# EAGLE design E6_funk_v2 (EAGLE 6.5.0)
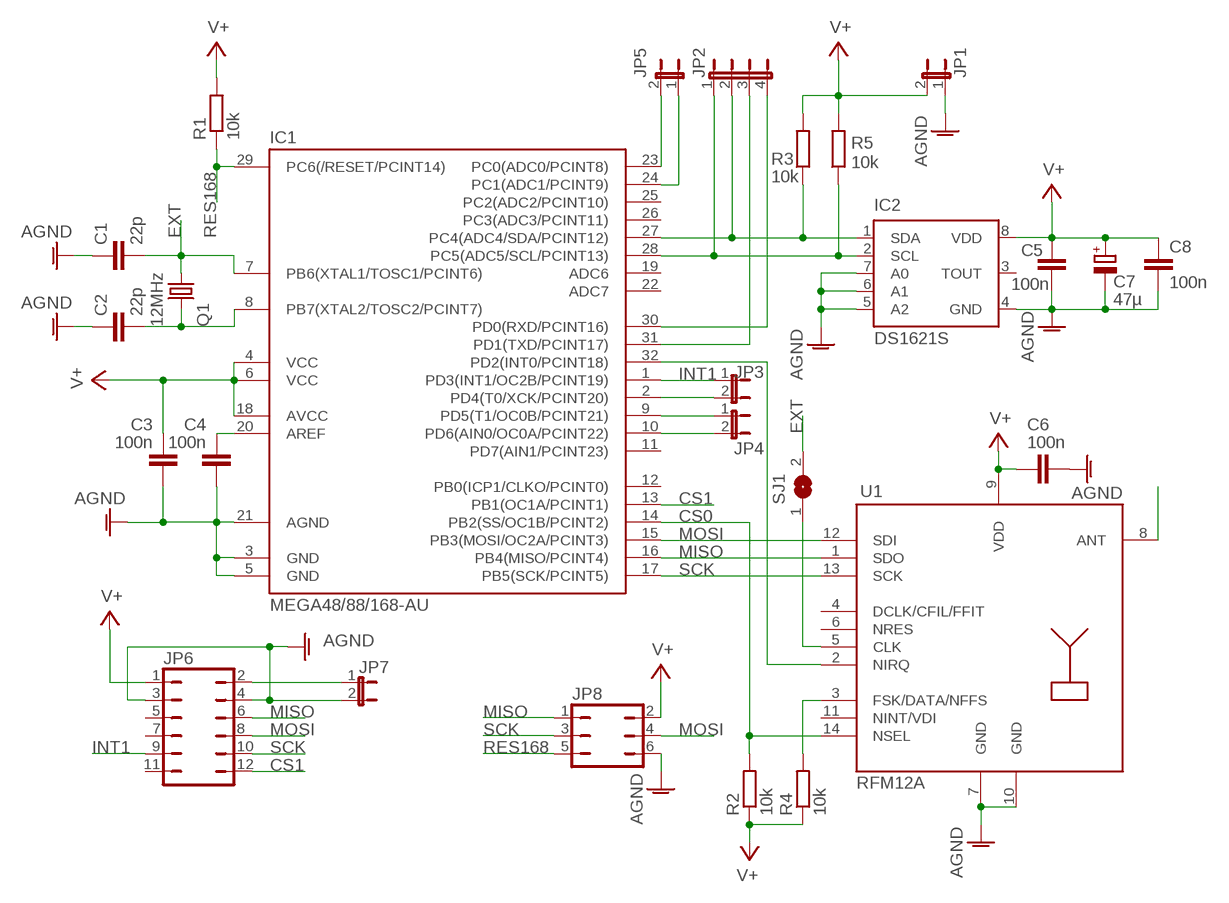
[diagram p0: schematic, sheet 1]

## Parts
C1  22p  C-EUC0805K  [C0805K]
C2  22p  C-EUC0805K  [C0805K]
C3  100n  C-EUC0805K  [C0805K]
C4  100n  C-EUC0805K  [C0805K]
C5  100n  C-EUC0805K  [C0805K]
C6  100n  C-EUC0805K  [C0805K]
C7  47µ  CPOL-EUSMCD  [SMC_D]
C8  100n  C-EUC0805K  [C0805K]
IC1  MEGA48/88/168-AU  [TQFP32-08]
IC2  DS1621S  [SO08]
JP1  JP1E  [JP1]
JP2  JP4E  [JP4]
JP3  JP1E  [JP1]
JP4  JP1E  [JP1]
JP5  JP1E  [JP1]
JP6  JP6Q  [JP6Q]
JP7  JP1E  [JP1]
JP8  JP3Q  [JP3Q]
Q1  12MHz  CRYSTALCTS406  [CTS406]
R1  10k  R-EU_R0805  [R0805]
R2  10k  R-EU_R0805  [R0805]
R3  10k  R-EU_R0805  [R0805]
R4  10k  R-EU_R0805  [R0805]
R5  10k  R-EU_R0805  [R0805]
SJ1  SJ  [SJ]
U1  RFM12A  [RFM1]

## Nets
ADC1: IC1.24(PC1(ADC1/PCINT9)) JP5.1
AGND: C1.2 C2.2 C3.1 C4.1 C5.2 C6.1 C7.- C8.2 IC1.3(GND) IC1.5(GND) IC1.21(AGND) IC2.4(GND) IC2.5(A2) IC2.6(A1) IC2.7(A0) JP1.1 JP6.3 JP6.4 JP7.2 JP8.6 U1.7(GND) U1.10(GND)
CS0: IC1.14(PB2(SS/OC1B/PCINT2)) R2.2 U1.14(NSEL)
CS1: IC1.13(PB1(OC1A/PCINT1)) JP6.12
EXT: C1.1 IC1.7(PB6(XTAL1/TOSC1/PCINT6)) Q1.1 SJ1.2
INT1: IC1.1(PD3(INT1/OC2B/PCINT19)) JP3.1 JP6.9
MISO: IC1.16(PB4(MISO/PCINT4)) JP6.6 JP8.1 U1.1(SDO)
MOSI: IC1.15(PB3(MOSI/OC2A/PCINT3)) JP6.8 JP8.4 U1.12(SDI)
N$1: IC1.23(PC0(ADC0/PCINT8)) JP5.2
N$56: C2.1 IC1.8(PB7(XTAL2/TOSC2/PCINT7)) Q1.3
N$74: IC1.32(PD2(INT0/PCINT18)) U1.2(NIRQ)
N$75: C4.2 IC1.20(AREF)
N$76: SJ1.1 U1.5(CLK)
N$77: R4.2 U1.3(FSK/DATA/NFFS)
N$170: U1.8(ANT)
PD4: IC1.2(PD4(T0/XCK/PCINT20)) JP3.2
PD5: IC1.9(PD5(T1/OC0B/PCINT21)) JP4.1
PD6: IC1.10(PD6(AIN0/OC0A/PCINT22)) JP4.2
RES168: IC1.29(PC6(/RESET/PCINT14)) JP8.5 R1.1
RXD: IC1.30(PD0(RXD/PCINT16)) JP2.4
SCK: IC1.17(PB5(SCK/PCINT5)) JP6.10 JP8.3 U1.13(SCK)
SCL: IC1.28(PC5(ADC5/SCL/PCINT13)) IC2.2(SCL) JP2.1 R5.1
SDA: IC1.27(PC4(ADC4/SDA/PCINT12)) IC2.1(SDA) JP2.2 R3.1
TXD: IC1.31(PD1(TXD/PCINT17)) JP2.3
V+: C3.2 C5.1 C6.2 C7.+ C8.1 IC1.4(VCC) IC1.6(VCC) IC1.18(AVCC) IC2.8(VDD) JP1.2 JP6.1 JP8.2 R1.2 R2.1 R3.2 R4.1 R5.2 U1.9(VDD)
VCC: JP6.2 JP7.1
Unconnected: IC1.11(PD7(AIN1/PCINT23)) IC1.12(PB0(ICP1/CLKO/PCINT0)) IC1.19(ADC6) IC1.22(ADC7) IC1.25(PC2(ADC2/PCINT10)) IC1.26(PC3(ADC3/PCINT11)) IC2.3(TOUT) JP6.5 JP6.7 JP6.11 U1.4(DCLK/CFIL/FFIT) U1.6(NRES) U1.11(NINT/VDI)

## Library data of the parts
C1-C6 C8 = rcl:C-EU: CAPACITOR, European symbol
C7 = rcl:CPOL-EU: POLARIZED CAPACITOR, European symbol
IC1 = avr-4:MEGA48/88/168
IC2 = maxim:DS1621: Digital Thermometer and Thermostat Source: http://pdfserv.maxim-ic.com/en/ds/DS1621.pdf
JP1 JP3-JP5 JP7 = jumper:JP1E: JUMPER
JP2 = jumper:JP4E: JUMPER
JP6 = jumper:JP6Q: JUMPER
JP8 = jumper:JP3Q: JUMPER
Q1 = crystal:CRYSTAL: CRYSTAL
R1-R5 = rcl:R-EU_: RESISTOR, European symbol
SJ1 = jumper:SJ: SMD solder JUMPER
U1 = RFMxx:RFM12A

## Board
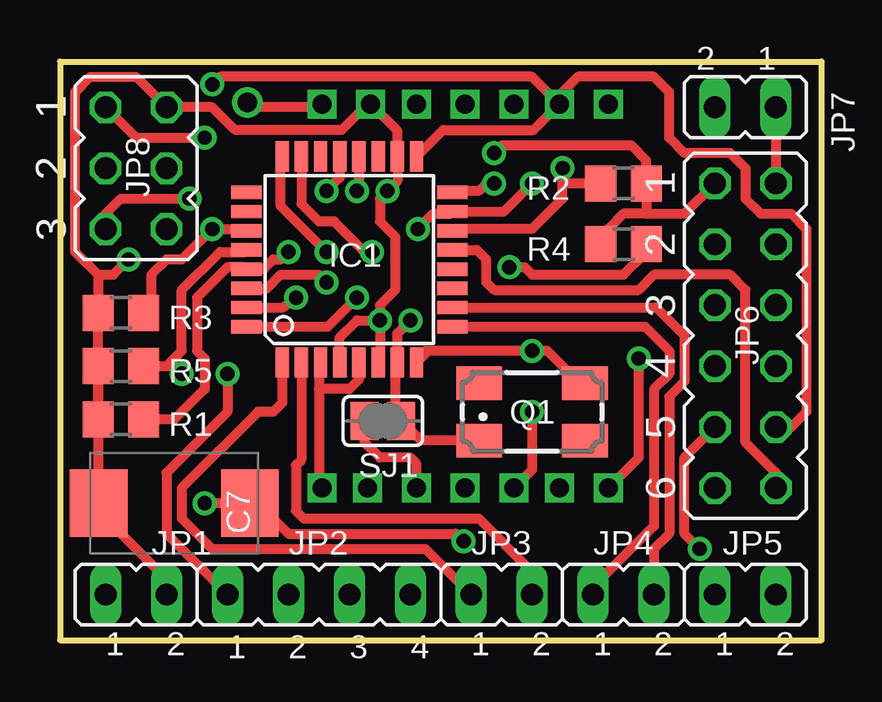
[diagram p1: board, top side]
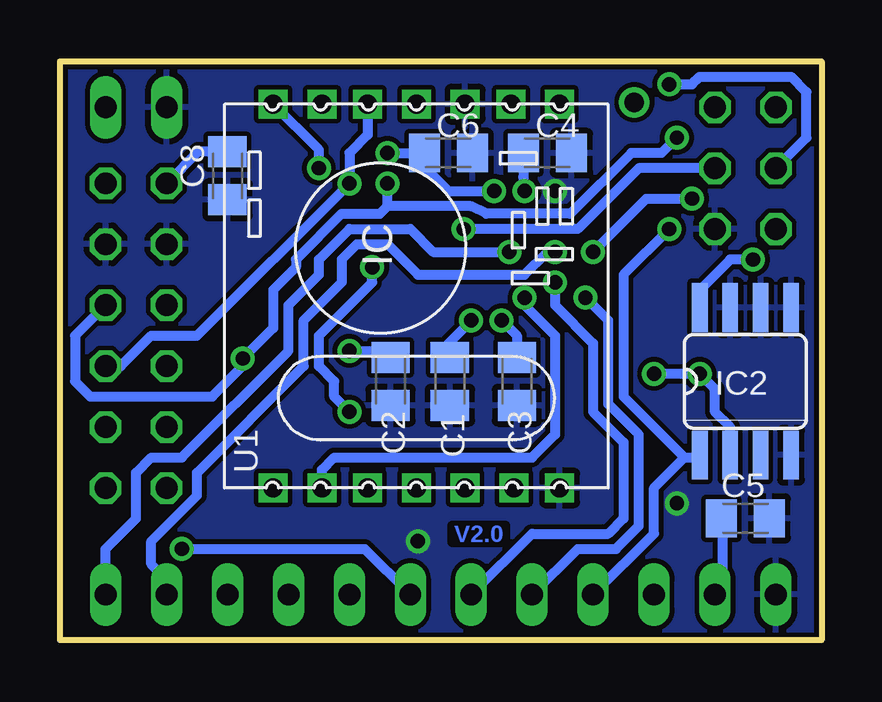
[diagram p2: board, bottom side, seen from below]

Size 31.75 x 24.13 mm. Coordinates in mm from the lower left corner, seen from the top.
Outline: 0,24.13 0,0 31.75,0 31.75,24.13 0,24.13
Copper layers (1*16): Top 0.035mm / dielectric 1.5mm / Bottom 0.035mm
Design rules "ZWILLING": minimum track width 0.2mm, minimum drill 0.5mm, track to track 0.2mm, track to pad 0.2mm, pad to pad 0.15mm, via to via 0.2mm, smd to smd 0mil, copper to edge 0.2mm, drill to drill 0.2mm, minimum pad ring 0.2mm, minimum via ring 0.2mm, stop-mask expansion 0.1mm, vias tented up to drill 0mil, thermal gap 10mil

### Footprints (pad centres in the part's own frame; a part is rotated, then mirrored left to right if it is on the bottom)
C0805K = smd 1.3 x 1.6: 1 -1,0; 2 1,0
SMC_D = smd 2.4 x 2.8: + -3.15,0; - 3.15,0
TQFP32-08 = smd 1.27 x 0.559: 1 -4.293,2.8; 2 -4.293,2; 3 -4.293,1.2; 4 -4.293,0.4; 5 -4.293,-0.4; 6 -4.293,-1.2; 7 -4.293,-2; 8 -4.293,-2.8; 17 4.293,-2.8; 18 4.293,-2; 19 4.293,-1.2; 20 4.293,-0.4; 21 4.293,0.4; 22 4.293,1.2; 23 4.293,2; 24 4.293,2.8 | smd 0.559 x 1.27: 9 -2.8,-4.293; 10 -2,-4.293; 11 -1.2,-4.293; 12 -0.4,-4.293; 13 0.4,-4.293; 14 1.2,-4.293; 15 2,-4.293; 16 2.8,-4.293; 25 2.8,4.293; 26 2,4.293; 27 1.2,4.293; 28 0.4,4.293; 29 -0.4,4.293; 30 -1.2,4.293; 31 -2,4.293; 32 -2.8,4.293
SO08 = smd 0.66 x 2.032: 1 -1.905,-3.073; 2 -0.635,-3.073; 3 0.635,-3.073; 4 1.905,-3.073; 5 1.905,3.073; 6 0.635,3.073; 7 -0.635,3.073; 8 -1.905,3.073
JP1 = drill 0.914 long: 1 0,-1.27; 2 0,1.27
JP4 = drill 0.914 long: 1 -3.81,0; 2 -1.27,0; 3 1.27,0; 4 3.81,0
JP6Q = drill 0.914 octagon: 1 -6.35,-1.27; 2 -6.35,1.27; 3 -3.81,-1.27; 4 -3.81,1.27; 5 -1.27,-1.27; 6 -1.27,1.27; 7 1.27,-1.27; 8 1.27,1.27; 9 3.81,-1.27; 10 3.81,1.27; 11 6.35,-1.27; 12 6.35,1.27
JP3Q = drill 0.914 octagon: 1 -2.54,-1.27; 2 -2.54,1.27; 3 0,-1.27; 4 0,1.27; 5 2.54,-1.27; 6 2.54,1.27
CTS406 = smd 1.9 x 1.4: 1 -2.2,-1.2; 2 2.2,-1.2; 3 2.2,1.2; 4 -2.2,1.2
R0805 = smd 1.3 x 1.5: 1 -0.95,0; 2 0.95,0
SJ = smd 1.168 x 1.6: 1 -0.762,0; 2 0.762,0
RFM1 = drill 0.8 square: 1 -7.62,5.08; 2 -7.62,3.048; 3 -7.62,1.143; 4 -7.62,-0.889; 5 -7.62,-2.921; 6 -7.62,-4.953; 7 -7.62,-6.858; 8 8.382,-6.858; 9 8.382,-4.826; 10 8.382,-2.921; 11 8.382,-0.889; 12 8.382,1.143; 13 8.382,3.048; 14 8.382,5.08

### Placement (x,y rotation side)
C1  15.49,10.79 270 bottom
C2  17.97,10.79 270 bottom
C3  12.7,10.79 90 bottom
C4  11.43,20.32 180 bottom
C5  3.17,5.08 0 bottom
C6  15.56,20.32 180 bottom
C7  4.76,5.71 0 top
C8  24.77,19.37 270 bottom
IC1  12.06,15.88 90 top
IC2  3.17,10.79 0 bottom
JP1  3.17,1.91 270 top
JP2  10.79,1.91 0 top
JP3  18.41,1.91 270 top
JP4  23.5,1.91 270 top
JP5  28.57,1.91 270 top
JP6  28.57,12.7 270 top
JP7  28.57,22.23 90 top
JP8  3.17,19.68 270 top
Q1  19.68,9.53 0 top
R1  2.54,9.21 180 top
R2  23.5,19.05 180 top
R3  2.54,13.65 180 top
R4  23.5,16.51 0 top
R5  2.54,11.43 180 top
SJ1  13.46,9.14 0 top
U1  17.78,13.97 90 bottom

### Tracks (layer width: path | path; a pad name or v marks a point on that pad's centre or on a via)
ADC1  (via drill 0.6)
  Top 0.406: v11.11,16.19 9.21,18.1 9.21,20.11 IC1.24
  Bottom 0.406: v11.11,16.19 11.43,16.19 12.38,15.24 16.83,15.24 18.1,16.51 19.37,16.51 20,15.88 20,14.92 21.59,13.34 21.59,11.43 26.04,6.99 26.04,6.03 27.94,4.13 27.94,3.17 27.3,2.54 JP5.1
AGND  (via drill 0.6)
  Top 0.406: IC1.5 12.46,10.88 12.06,10.48 10.79,10.48 | IC1.3 10.87,11.5 10.79,11.43 10.79,10.48 | 10.79,10.48 10.79,6.48 U1.7 | v6.03,5.71 C7.- 8.26,5.71 9.53,4.45 16.51,4.45 v16.83,4.13 | IC1.21 11.66,19.29 v11.11,18.73
  pour Bottom: 31.75,24.13 0,24.13 0,0 31.75,0
CS0  (via drill 0.6)
  Top 0.406: IC1.14 16.43,17.14 19.68,17.14 20.95,18.41 20.95,19.05 | 20.95,19.05 v20.95,19.68 | R2.2 20.95,19.05
  Bottom 0.406: v20.95,19.68 20.95,20.45 U1.14
CS1
  Top 0.406: IC1.13 17.38,16.27 17.78,15.88 17.78,14.92 18.1,14.61 24.13,14.61 24.77,15.24 27.94,15.24 28.57,14.61 28.57,8.26 29.84,6.99 JP6.12
EXT  (via drill 0.6)
  Top 0.406: Q1.1 15.04,8.32 SJ1.2 13.97,9.4 13.97,11.43 14.06,11.53 IC1.7 14.06,12.79 v14.61,13.34
  Bottom 0.406: C1.1 15.88,12.06 14.62,13.32 14.62,13.35 v14.61,13.34
INT1  (via drill 0.6)
  Top 0.406: IC1.1 9.27,9.9 8.89,9.53 8.26,9.53 5.08,6.35 5.08,5.08 6.35,3.81 15.24,3.81 JP3.1 | v26.67,3.81 26.04,4.45 26.04,7.62 JP6.9
  Bottom 0.406: v26.67,3.81 19.05,3.81 JP3.1
MISO  (via drill 0.6)
  Top 0.406: JP8.1 3.17,20.95 v6.03,20.95 | v18.1,19.05 17.78,19.05 17.46,18.73 16.41,18.73 IC1.16 | U1.1 24.13,7.62 v24.13,11.75
  Bottom 0.406: 18.1,18.1 14.61,18.1 13.97,17.78 10.48,17.78 7.94,20.32 6.67,20.32 v6.03,20.95 | JP6.6 31.11,12.7 31.11,10.79 30.48,10.16 25.4,10.16 24.13,11.43 v24.13,11.75 22.86,13.02 22.86,14.61 21.91,15.56 21.91,15.88 20,17.78 18.41,17.78 18.1,18.1 | 18.1,18.1 v18.1,19.05
MOSI  (via drill 0.6)
  Top 0.406: v14.92,17.14 15.56,17.78 16.26,17.78 IC1.15 18.51,17.88 v19.68,19.05
  Bottom 0.406: JP8.4 7.62,19.68 10.16,17.14 v14.92,17.14 | JP6.8 29.21,11.43 27.94,12.7 26.04,12.7 v19.68,19.05 19.68,20.32 18.92,21.08 U1.12
N$1  (via drill 0.6)
  Top 0.406: v13.02,16.19 12.7,16.19 11.43,17.46 10.79,17.46 10.06,18.19 IC1.23
  Bottom 0.406: JP5.2 29.84,3.81 28.57,5.08 28.57,6.99 27.94,7.62 26.67,7.62 22.23,12.06 22.23,13.97 20.95,15.24 20.95,15.88 19.68,17.14 17.14,17.14 16.19,16.19 v13.02,16.19
N$2
  Top 0.406: 10.79,22.23 8.26,22.23 7.94,22.54
N$56  (via drill 0.6)
  Top 0.406: Q1.3 21.66,10.72 20.32,12.06 v19.68,12.06 15.24,12.06 15.24,11.96 IC1.8
  Bottom 0.406: v19.68,12.06 18.11,12.06 C2.1
N$74  (via drill 0.6)
  Top 0.406: IC1.32 11.17,13.07 v12.38,14.29
  Bottom 0.406: U1.2 20.83,7.11 20.32,7.62 12.06,7.62 11.11,8.57 11.11,12.7 12.38,13.97 v12.38,14.29
N$75  (via drill 0.6)
  Top 0.406: IC1.20 12.46,19.29 v12.38,18.73
  Bottom 0.406: C4.2 12.43,19.32 v12.38,18.73
N$76
  Top 0.406: U1.5 14.86,7.37 14.61,7.62 13.34,7.62 12.7,8.26 SJ1.1
N$77  (via drill 0.6)
  Top 0.406: v19.68,9.53 19.68,7.11 U1.3 | v18.73,15.56 19.37,15.56 19.68,15.24 23.5,15.24 24.45,16.19 R4.2
  Bottom 0.406: v19.68,9.53 20.32,10.16 20.32,10.79 20.95,11.43 20.95,12.7 18.73,14.92 v18.73,15.56
N$171  (via drill 0.8 pad 1.27)
  other vias: 7.81,22.43
PD4
  Top 0.406: IC1.2 10.06,7.53 9.84,7.3 9.84,5.4 10.16,5.08 17.46,5.08 19.68,2.86 JP3.2
PD5
  Top 0.406: IC1.9 24.39,13.07 25.4,12.06 25.4,11.11 24.77,10.48 24.77,4.76 22.23,2.22 JP4.1
PD6
  Top 0.406: IC1.10 24.86,13.88 26.04,12.7 26.04,10.79 25.4,10.16 25.4,4.45 24.77,3.81 JP4.2
RES168  (via drill 0.6)
  Top 0.406: R1.1 4.76,9.21 6.03,10.48 6.03,11.75 5.71,12.06 5.71,14.29 6.99,15.56 7.69,15.56 IC1.29 8.49,15.47 8.89,15.88 9.21,15.88 v9.53,16.19 | JP8.5 1.91,17.78 2.54,18.41 v5.4,18.41
  Bottom 0.406: v9.53,16.19 7.3,18.41 v5.4,18.41
RXD  (via drill 0.6)
  Top 0.406: IC1.30 8.64,14.68 9.21,15.24 10.79,15.24 v11.11,14.92
  Bottom 0.406: JP2.4 12.06,4.45 8.89,4.45 8.26,5.08 8.26,8.26 9.53,9.53 9.53,12.38 11.11,13.97 v11.11,14.92
SCK  (via drill 0.6)
  Top 0.406: U1.13 20.83,22.1 | IC1.17 15.97,21.27 19.75,21.27 U1.13 | U1.13 20.95,22.48 20.95,22.86 21.59,23.5 24.77,23.5 25.4,22.86 25.4,20.95 26.04,20.32 27.94,20.32 28.57,19.68 28.57,18.41 29.21,17.78 30.48,17.78 31.11,17.14 31.11,9.53 30.48,8.89 JP6.10 | U1.13 19.68,23.5 6.67,23.5 v6.35,23.18
  Bottom 0.406: JP8.3 0.64,20.95 0.64,22.86 1.27,23.5 5.08,23.5 5.4,23.18 v6.35,23.18
SCL  (via drill 0.6)
  Top 0.406: JP2.1 4.45,4.45 4.45,6.99 6.99,9.53 v6.99,11.11 | R5.1 4.45,11.43 | 4.45,11.43 5.08,12.06 5.08,14.61 6.67,16.19 7.69,16.19 IC1.28 | 4.45,11.43 4.76,11.43 v5.08,11.11
  Bottom 0.406: IC2.2 3.81,8.89 4.45,9.53 4.45,10.48 v5.08,11.11 v6.99,11.11
SDA  (via drill 0.6)
  Top 0.406: IC1.27 7.7,17.14 v6.35,17.14 5.08,15.88 4.45,15.88 3.81,15.24 3.81,13.97 R3.1
  Bottom 0.406: JP2.2 6.99,4.45 6.99,6.35 5.71,7.62 | 5.71,7.62 5.18,7.62 IC2.1 | v6.35,17.14 8.26,15.24 8.26,10.16 5.71,7.62
TXD  (via drill 0.6)
  Top 0.406: IC1.31 9.3,13.88 v9.84,14.29
  Bottom 0.406: JP2.3 10.16,3.81 8.57,3.81 7.62,4.76 7.62,8.57 8.89,9.84 8.89,13.34 v9.84,14.29
V+  (via drill 0.6)
  Top 0.406: v13.34,13.34 13.34,11.65 IC1.6 | IC1.4 11.66,12.62 12.38,13.34 v13.34,13.34 | JP6.1 26.04,17.78 24.45,17.78 | v18.1,20.32 18.41,20.64 23.81,20.64 24.45,20 R2.1 24.45,17.78 | IC1.18 14.06,19.78 | v13.34,13.34 13.34,13.97 13.97,14.61 13.97,16.83 13.34,17.46 13.34,18.41 v13.65,18.73 14.06,19.14 IC1.18 | 1.59,15.24 0.64,16.19 0.64,22.86 1.27,23.5 3.17,23.5 JP8.2 6.35,22.23 7.3,21.27 11.75,21.27 12.83,22.35 U1.9 14.06,21.24 IC1.18 | 1.59,15.24 1.59,13.97 R3.2 R1.2 R5.2 1.59,5.74 C7.+ 1.91,5.42 1.91,5.08 4.45,2.54 JP1.2 | 1.59,15.24 2.22,15.24 v2.86,15.88 | 24.45,17.78 23.5,17.78 22.86,17.14 22.86,16.82 R4.1
  Bottom 0.406: C5.1 4.17,4.81 4.13,4.76 4.13,2.22 JP1.2 | IC2.8 5.08,14.61 3.81,15.88 v2.86,15.88 | C8.1 25.99,20.37 JP6.1 | v13.34,13.34 12.7,12.7 C3.2 | v18.1,20.32 C6.2 16.51,20.32 16.51,19.68 15.56,18.73 v13.65,18.73
VCC
  Top 0.406: JP7.1 JP6.2

### Text on the board
Bottom: V2.0
tValues: GND | VCC (<7V) | GND | +3...5V | I2C SCL | I2C SDA | TXD | RXD | PD3 | PD4 | PD5 | PD6 | ADC1 | ADC0